# Altium schematic sheet WifiModule.SchDoc
size A; SheetNumber: 3; SheetTotal: 3
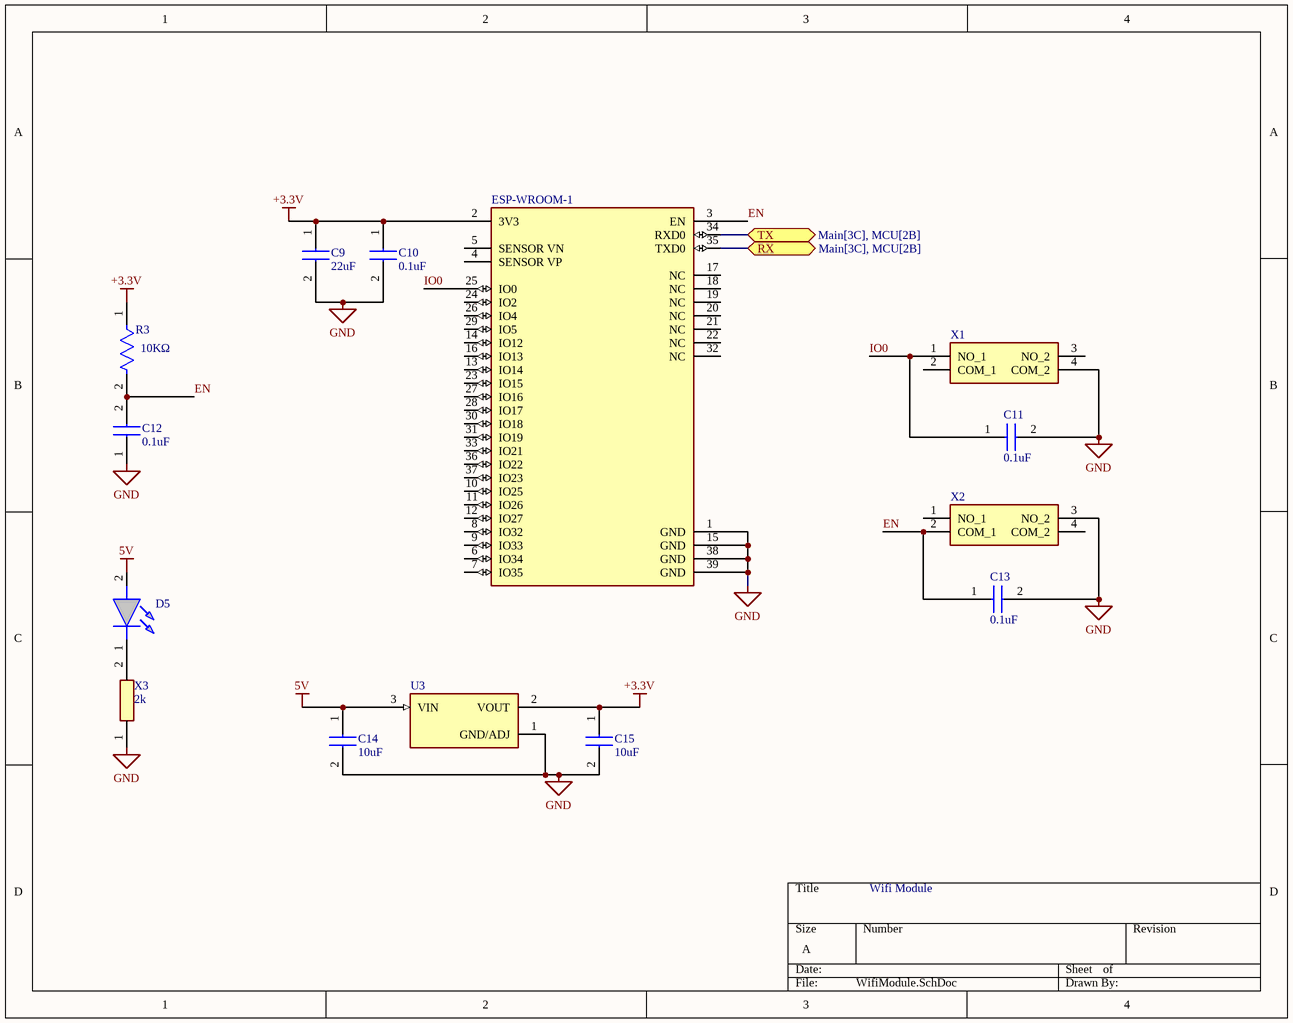
[diagram p0: WifiModule.SchDoc]

## Parts
C9  Capacitamce: 22uF  [CAPC2012X150N]  (hidden comment: CL31B226KPKVPJE)
C10  Capacitance: 0.1uF  [CAPC3216X110N]  (hidden comment: C1206C104K5RAC7867)
C11  Capacitance: 0.1uF  [CAPC3216X110N]  (hidden comment: C1206C104K5RAC7867)
C12  Capacitance: 0.1uF  [CAPC3216X110N]  (hidden comment: C1206C104K5RAC7867)
C13  Capacitance: 0.1uF  [CAPC3216X110N]  (hidden comment: C1206C104K5RAC7867)
C14  Capacitance: 10uF  [CAPC3216X180N]  (hidden comment: C1206C106K8RAC)
C15  Capacitance: 10uF  [CAPC3216X180N]  (hidden comment: C1206C106K8RAC)
D5  150120GS75000  [LEDC3214X78N]  (value not drawn)
ESP-WROOM-1  ESP32-WROOM-32E (16MB)  [FP-ESP32-WROOM-32E_16MB-MFG]  (value not drawn)
R3  value 10KΩ  [FP-CRGP1210-IPC_A]  (hidden comment: CRGP1210F10K)
U3  AMS1117-3.3  [SOT229P700X180-4N]  (value not drawn)
X1  TS04-66-65-BK-160-SMT  [TS046665BK160SMT]  (value not drawn)
X2  TS04-66-65-BK-160-SMT  [TS046665BK160SMT]  (value not drawn)
X3  Resistance: 2k  [RESC3116X65X50LL20T20]  (hidden comment: CHP1206AFX-2001ELF)

## Ports
RX (bidir, see Main[3C], MCU[2B]), TX (bidir, see Main[3C], MCU[2B])

## Nets
5V: C14.1 D5.2(A) U3.3(VIN)
+3.3V: C9.1 C10.1 C15.1 ESP-WROOM-1.2(3V3) R3.1 U3.2(VOUT)
GND: C9.2 C10.2 C11.2 C12.1 C13.2 C14.2 C15.2 ESP-WROOM-1.1(GND) ESP-WROOM-1.15(GND) ESP-WROOM-1.38(GND) ESP-WROOM-1.39(GND) U3.1(GND/ADJ) X1.4(COM_2) X2.3(NO_2) X3.1
EN: C12.2 C13.1 ESP-WROOM-1.3(EN) R3.2 X2.2(COM_1)
IO0: C11.1 ESP-WROOM-1.25(IO0) X1.1(NO_1)
RX: ESP-WROOM-1.35(TXD0) ; port RX
TX: ESP-WROOM-1.34(RXD0) ; port TX
NetD5_1: D5.1(K) X3.2

Not connected (* = marked no-connect by the designer): ESP-WROOM-1 4(SENSOR_VP) 5(SENSOR_VN) 6(IO34) 7(IO35) 8(IO32) 9(IO33) 10(IO25) 11(IO26) 12(IO27) 13(IO14) 14(IO12) 16(IO13) 17(NC) 18(NC) 19(NC) 20(NC) 21(NC) 22(NC) 23(IO15) 24(IO2) 26(IO4) 27(IO16) 28(IO17) 29(IO5) 30(IO18) 31(IO19) 32(NC) 33(IO21) 36(IO22) 37(IO23); X1 2(COM_1) 3(NO_2); X2 1(NO_1) 4(COM_2)

## Notes on the sheet
- Wifi Module

## Library data of the parts
C9 = CL31B226KPKVPJE: General Multilayer Ceramic Capacitors; Manufacturer_Name: SAMSUNG; Geometry.Height: 1.5mm; Mouser Part Number: 187-CL31B226KPKVPJE; Mouser Price/Stock: https://www.mouser.co.uk/ProductDetail/Samsung-Electro-Mechanics/CL31B226KPKVPJE?qs=Jm2GQyTW%2Fbh6Hm6JEZyOWg%3D%3D; Manufacturer_Part_Number: CL31B226KPKVPJE; Datasheet Link: *
C10-C13 = C1206C104K5RAC7867: Multilayer Ceramic Capacitors MLCC - SMD/SMT 50V 0.1uF X7R 1206 10%; Manufacturer_Name: KEMET; Geometry.Height: 1.1mm; Mouser Part Number: 80-C1206104K5RAC7867; Mouser Price/Stock: https://www.mouser.co.uk/ProductDetail/KEMET/C1206C104K5RAC7867?qs=r%2FVmNO8Tjq5MvP%2FjoJQjcw%3D%3D; Manufacturer_Part_Number: C1206C104K5RAC7867; Datasheet Link: https://content.kemet.com/datasheets/KEM_C1002_X7R_SMD.pdf
C14 C15 = C1206C106K8RAC: Multilayer Ceramic Capacitors MLCC - SMD/SMT 10V 10uF X7R 1206 0.1; Manufacturer_Name: KEMET; Geometry.Height: 1.8mm; Mouser Part Number: 80-C1206C106K8RAC; Mouser Price/Stock: https://www.mouser.co.uk/ProductDetail/KEMET/C1206C106K8RAC?qs=IIhARexJuViDIgySPNv42g%3D%3D; Manufacturer_Part_Number: C1206C106K8RAC; Datasheet Link: https://www.mouser.in/datasheet/2/212/KEM_C1002_X7R_SMD-1102033.pdf
D5 = 150120GS75000: LED,Wurth Elektronik,150120GS75000 Wurth Elektronik 150120GS75000, WL-SMCW Series Green LED, 520 nm, 3016 (1206) Clear, Rectangle Lens SMD Package; Geometry.Height: 0.78mm; Mouser Part Number: 710-150120GS75000; Mouser Price/Stock: https://www.mouser.co.uk/ProductDetail/Wurth-Elektronik/150120GS75000?qs=LlUlMxKIyB3I3AMxrmBw4A%3D%3D; Manufacturer_Name: Wurth Elektronik; Manufacturer_Part_Number: 150120GS75000; Datasheet Link: *
ESP-WROOM-1 = CMP-194065-000027-1: RX TXRX MOD WIFI TRACE ANT SMD
R3 = CMP-03211-008532-1: CRGP1210 10KΩ 0.75W ±100ppm/°C 1% 200V; Manufacturer: TE; Tolerance: 0.01; Package: CRGP1210; Octopart: https://octopart.com/crgp1210f10k-te+connectivity-91018904; Device Class L2: Resistors; Temperature Coefficient: ±100ppm/°C; Resistance: 10KΩ; ComponentLink2URL: https://www.te.com/commerce/DocumentDelivery/DDEController?Action=srchrtrv&DocNm=9-1773463-9&DocType=Data+Sheet&DocLang=English&DocFormat=pdf&PartCntxt=4-2176329-922; ComponentLink2Description: Datasheet; Voltage Rating: 200V; Device Class L3: Chip SMD Resistors; Manufacturer Part Number: CRGP1210F10K; Height: 0.65mm; Temperature Range Low: -55°C; Category: Res; Series: CRGP; Lead Free: Yes; RoHS: TRUE; Device Class L1: Passive Components; Composition: Thick Film; Temperature Range High: +155°C; Temperature: -55°C to +155°C; Power Rating: 0.75W; Ipc Land Pattern Name: RESC310260X55; Automotive: No
U3 = AMS1117-3.3: Sot223/Pkg 1-Amp 3.3-Volt Low Drop Out Voltage Regulatator; MF: Advanced Monolithic Systems; Package: SOT-223 Seeed Technology; Value: *; Check_prices: https://www.snapeda.com/parts/AMS1117-3.3/Advanced+Monolithic+Systems/view-part/?ref=eda; Price: None; Availability: Not in stock; MP: AMS1117-3.3; SnapEDA_Link: https://www.snapeda.com/parts/AMS1117-3.3/Advanced+Monolithic+Systems/view-part/?ref=snap
X1 X2 = TS04-66-65-BK-160-SMT: Tactile Switches 6 x 6 mm, 6.5 mm Act Height, 160 gf, Black, Surface Mount, SPST,; Manufacturer_Name: CUI Devices; Geometry.Height: 6.7mm; Mouser Part Number: 179-TS046665BK160SMT; Mouser Price/Stock: https://www.mouser.co.uk/ProductDetail/CUI-Devices/TS04-66-65-BK-160-SMT?qs=A6eO%252BMLsxmTgRLoTHWtDYQ%3D%3D; Manufacturer_Part_Number: TS04-66-65-BK-160-SMT; Datasheet Link: https://www.cuidevices.com/product/resource/ts04.pdf
X3 = CHP1206AFX-2001ELF: Thick Film Resistors - SMD ResHighPowerA 1206 2k 1% 3/4W TC100 AEC-Q200; Manufacturer_Name: Bourns; Geometry.Height: 0.65mm; Mouser Part Number: 652-CHP1206AFX-2001L; Mouser Price/Stock: https://www.mouser.co.uk/ProductDetail/Bourns/CHP1206AFX-2001ELF?qs=GedFDFLaBXERFI3Dnxqg6Q%3D%3D; Manufacturer_Part_Number: CHP1206AFX-2001ELF; Datasheet Link: https://www.mouser.mx/datasheet/2/54/chp-a-1858677.pdf